# Altium project E-Field-Near-Field Probe.PrjPcb
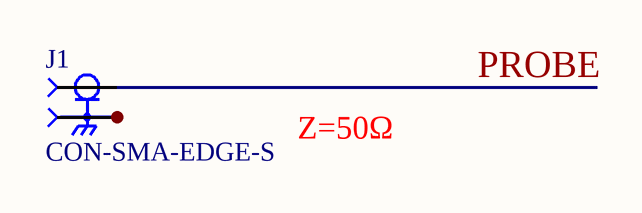
[diagram p0: NearField_E_Probe.SchDoc]
1 sheet, 1 parts. Net scope: global (net labels, ports and power ports of the same name join across sheets).
Board file: Near-E-Filed-Probe.PcbDoc

## Sheet NearField_E_Probe.SchDoc: E-Filed-Near-Filed-Probes
size A4; Author: Ravi kumar dusi; SheetNumber: 1; SheetTotal: 1

### Parts
J1  CON-SMA-EDGE-S  [RFSOLUTIONS_CON-SMA-EDGE-S]

### Nets
NetJ1_G1: J1.G1 J1.G2 J1.G3 J1.G4

Not connected (* = marked no-connect by the designer): J1 1

### Notes on the sheet
- Z=50Ω
- PROBE
- TITLE:
- DOCUMENT NAME:
- AUTHOR :
- REVIEWER:
- This document is created for Mitai. Any further questions can be asked through teams@mitai.ai
- Sheet
- PART NO.:
- of
- DATE:
- *
- TEMPLATE:
- A4
- Contact Address:Rosenheimer Straße 116b,81669, München.

### Library data of the parts
J1 = CON-SMA-EDGE-S: SMA Connector Jack, Female Socket - Board Edge, End Launch Solder; MF: RF Solutions; Value: *; SnapEDA_Link: https://www.snapeda.com/parts/CON-SMA-EDGE-S/RF+Solutions/view-part/?ref=snap; Purchase-URL: https://pricing.snapeda.com/search/part/CON-SMA-EDGE-S/?ref=eda; Check_prices: https://www.snapeda.com/parts/CON-SMA-EDGE-S/RF+Solutions/view-part/?ref=eda; Digi-Key_Part_Number: CON-SMA-EDGE-S-ND; Package: None; MP: CON-SMA-EDGE-S